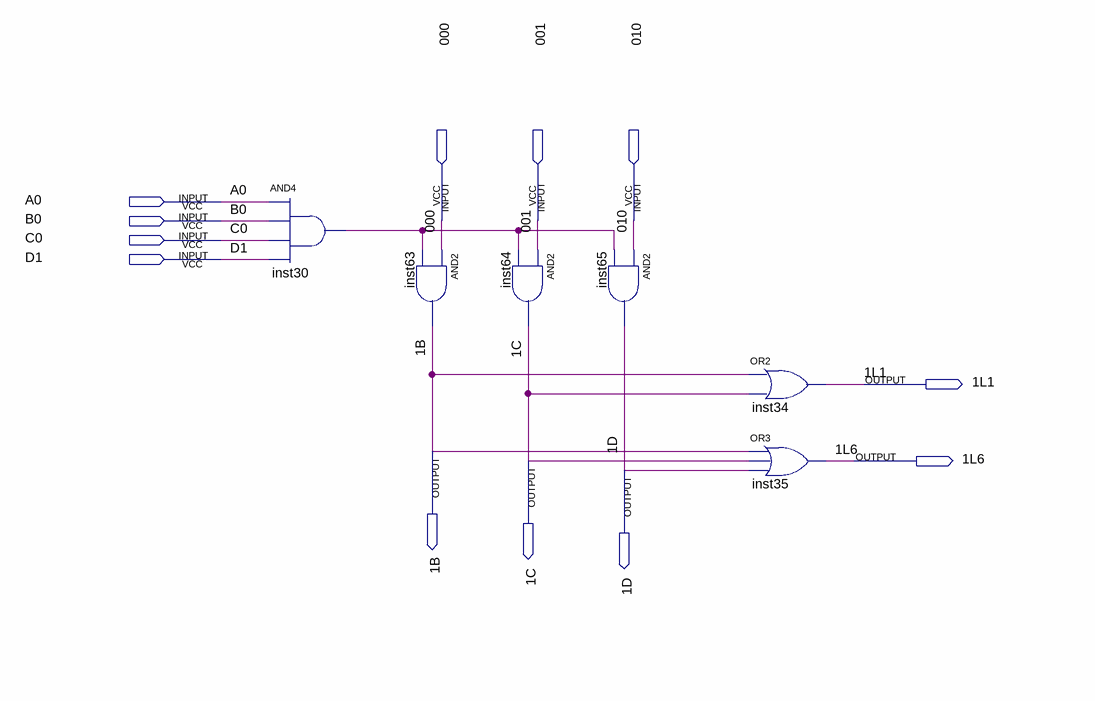
[diagram p0: schematic sheet]
// Quartus schematic carac1.bdf as structural Verilog: 6 symbols, 12 pins
module carac1 (
  input  A0,
  input  B0,
  input  \000 ,
  input  \001 ,
  input  \010 ,
  input  C0,
  input  D1,
  output \1L1 ,
  output \1B ,
  output \1C ,
  output \1L6 ,
  output \1D 
);

  wire inst30_out;

  and inst30 (inst30_out, A0, B0, C0, D1);
  and inst63 (\1B , \000 , inst30_out);
  and inst64 (\1C , \001 , inst30_out);
  and inst65 (\1D , \010 , inst30_out);
  or inst34 (\1L1 , \1B , \1C );
  or inst35 (\1L6 , \1B , \1C , \1D );
endmodule
